# Altium project OK6410.PRJPCB (part 1 of 2)
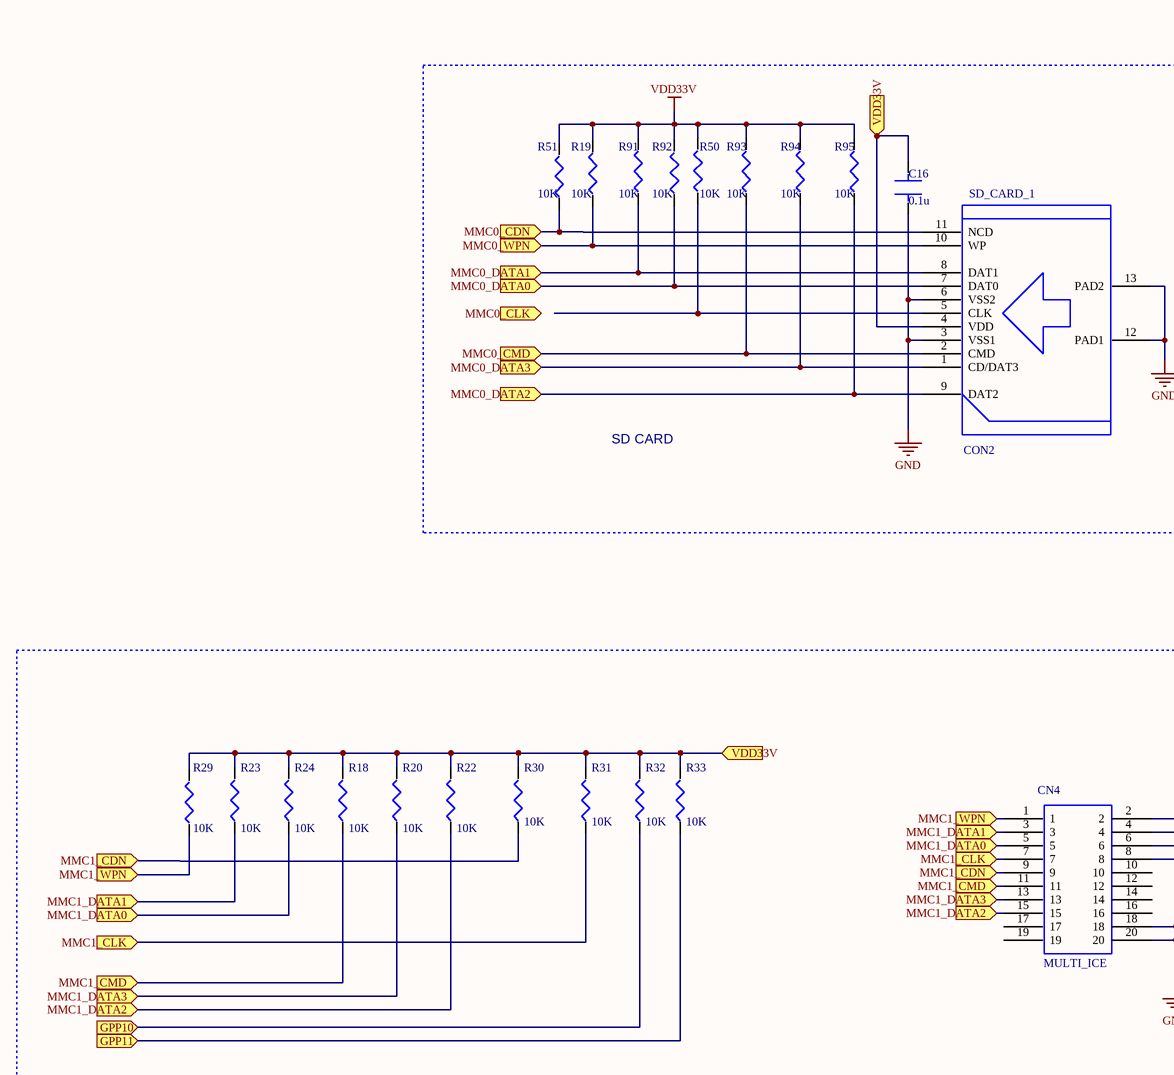
[diagram p0: SD_SD_WIFI.SchDoc, top left]
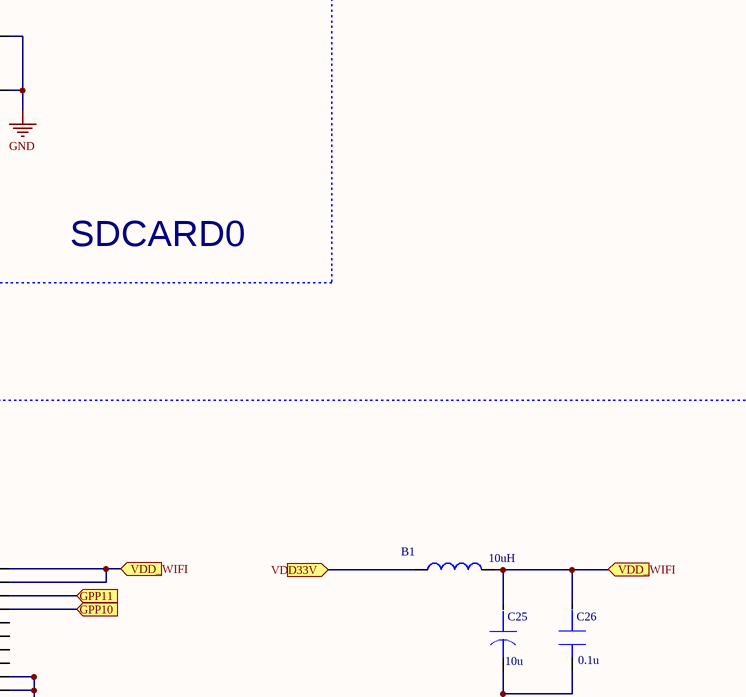
[diagram p1: SD_SD_WIFI.SchDoc, top right]
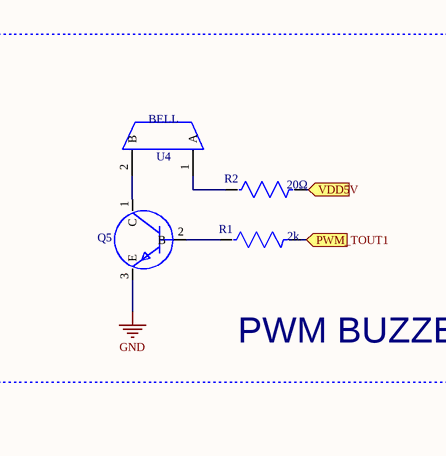
[diagram p2: SD_SD_WIFI.SchDoc, bottom left]
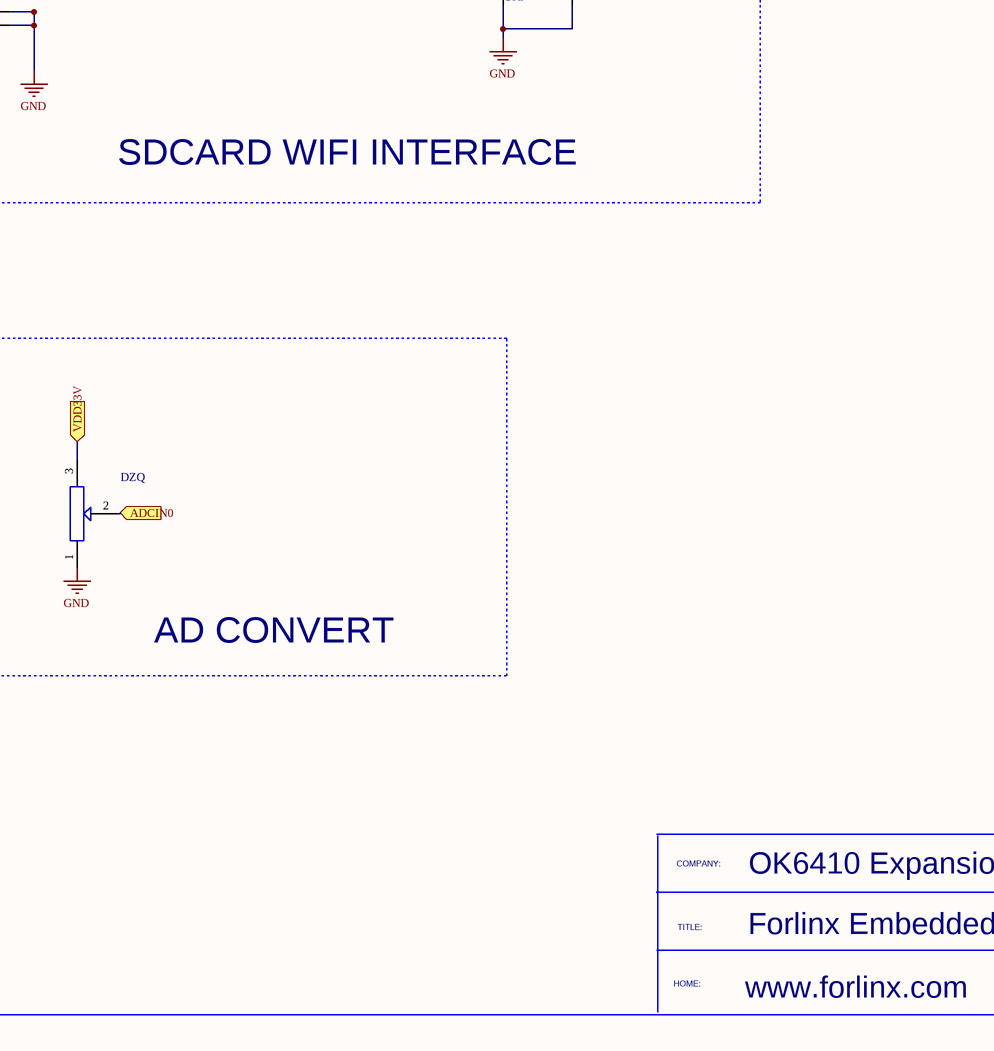
[diagram p3: SD_SD_WIFI.SchDoc, bottom right]
9 sheets, 253 parts. Net scope: flat (ports and power ports of the same name join across sheets).
Sheets:
  SD_SD_WIFI.SchDoc
  AUDIO.SchDoc
  CAM_LCD_TV.SchDoc
  COM_JTAG.SchDoc
  CON_USER_BATTER.SchDoc
  LED_USB_KEY.SchDoc
  NET.SchDoc
  POWER.SchDoc
  REVISION_HISTORY.SchDoc

## Sheet SD_SD_WIFI.SchDoc
size 558 x 431 mm

### Parts
B1  value 10uH  (hidden comment: INDUCTOR_0)
C16  value 0.1u  (hidden comment: CAP_0)
C25  value 10u  (hidden comment: CAP-AE4)
C26  value 0.1u  (hidden comment: CAP1206)
CN4  MULTI_ICE
CON2  SD_CARD_1
DZQ  VR  (value not drawn)
Q5  BC328NPN  (value not drawn)
R1  value 2k  (hidden comment: RES-1/4W)
R2  value 20Ω  (hidden comment: RES-1/4W)
R18  value 10K  (hidden comment: RESISTOR_2)
R19  value 10K  (hidden comment: RESISTOR_2)
R20  value 10K  (hidden comment: RESISTOR_2)
R22  value 10K  (hidden comment: RESISTOR_2)
R23  value 10K  (hidden comment: RESISTOR_2)
R24  value 10K  (hidden comment: RESISTOR_2)
R29  value 10K  (hidden comment: RESISTOR_2)
R30  value 10K  (hidden comment: RESISTOR_2)
R31  value 10K  (hidden comment: RESISTOR_2)
R32  value 10K  (hidden comment: RESISTOR_2)
R33  value 10K  (hidden comment: RESISTOR_2)
R50  value 10K  (hidden comment: RESISTOR_2)
R51  value 10K  (hidden comment: RESISTOR_2)
R91  value 10K  (hidden comment: RESISTOR_2)
R92  value 10K  (hidden comment: RESISTOR_2)
R93  value 10K  (hidden comment: RESISTOR_2)
R94  value 10K  (hidden comment: RESISTOR_2)
R95  value 10K  (hidden comment: RESISTOR_2)
U4  BELL

### Blocks framed on the sheet
SDCARD0: C16 CON2 R19 R50 R51 R91-R95
SDCARD WIFI INTERFACE: B1 C25 C26 CN4 R18 R20 R22-R24 R29-R33
PWM BUZZER: Q5 R1 R2 U4
AD CONVERT: DZQ

### Ports
ADCIN0, GPP10, GPP11, MMC0_CDN, MMC0_CLK, MMC0_CMD, MMC0_DATA0, MMC0_DATA1, MMC0_DATA2, MMC0_DATA3, MMC0_WPN, MMC1_CDN, MMC1_CLK, MMC1_CMD, MMC1_DATA0, MMC1_DATA1, MMC1_DATA2, MMC1_DATA3, MMC1_WPN, PWM_TOUT1, VDD5V, VDD33V, VDD_WIFI

### Nets
GND: C16.2 C25.2 C26.2 CN4.18 CN4.20 CON2.3(VSS1) CON2.6(VSS2) CON2.12(PAD1) CON2.13(PAD2) DZQ.1(VCC) Q5.3(E)
VDD33V: R19.2 R50.2 R51.2 R91.2 R92.2 R93.2 R94.2 R95.2
NetB1_1: B1.1 C16.1 CON2.4(VDD) DZQ.3(VCC) R18.2 R20.2 R22.2 R23.2 R24.2 R29.2 R30.2 R31.2 R32.2 R33.2 ; port VDD33V
NetB1_2: B1.2 C25.1 C26.1 CN4.2 CN4.4 ; port VDD_WIFI
NetB2_1: R2.2 ; port VDD5V
NetCN4_1: CN4.1 R29.1 ; port MMC1_WPN
NetCN4_3: CN4.3 R23.1 ; port MMC1_DATA1
NetCN4_5: CN4.5 R24.1 ; port MMC1_DATA0
NetCN4_6: CN4.6 R33.1 ; port GPP11
NetCN4_7: CN4.7 R31.1 ; port MMC1_CLK
NetCN4_8: CN4.8 R32.1 ; port GPP10
NetCN4_9: CN4.9 R30.1 ; port MMC1_CDN
NetCN4_11: CN4.11 R18.1 ; port MMC1_CMD
NetCN4_13: CN4.13 R20.1 ; port MMC1_DATA3
NetCN4_15: CN4.15 R22.1 ; port MMC1_DATA2
NetCON2_1: CON2.1(CD/DAT3) R94.1 ; port MMC0_DATA3
NetCON2_2: CON2.2(CMD) R93.1 ; port MMC0_CMD
NetCON2_5: CON2.5(CLK) R50.1
NetCON2_7: CON2.7(DAT0) R92.1 ; port MMC0_DATA0
NetCON2_8: CON2.8(DAT1) R91.1 ; port MMC0_DATA1
NetCON2_9: CON2.9(DAT2) R95.1 ; port MMC0_DATA2
NetCON2_10: CON2.10(WP) R19.1 ; port MMC0_WPN
NetCON2_11: CON2.11(NCD) R51.1 ; port MMC0_CDN
NetDZQ_2: DZQ.2(VCC) ; port ADCIN0
NetJ1_47: R1.2 ; port PWM_TOUT1
NetQ5_1: Q5.1(C) U4.2(B)
NetQ5_2: Q5.2(B) R1.1
NetR2_1: R2.1 U4.1(A)

Not connected (* = marked no-connect by the designer): CN4 10 12 14 16 17 19

### Notes on the sheet
- SD CARD
- COMPANY:
- TITLE:
- OK6410 Expansion Board
- HOME:
- www.forlinx.com
- Forlinx Embedded

### Library data of the parts
B1 = INDUCTOR_0: PCB DECAL: 1206
C16 = CAP_0: PCB Footprint: C2012; PCB DECAL: 0603A
C25 = CAP-AE4: ALUMINUM ELECTROLYTIC CAP.; Manufacturer #1: IPC SM-782 STD.; PCB DECAL: 3216A
C26 = CAP1206: SURFACE MOUNT CAPACITOR 0.062 X 0.126 INCHES; Manufacturer #1: IPC SM-782 STD.; PCB DECAL: 0603A
CN4 = MULTI_ICE: PCB Footprint: 3F-20PA; PCB DECAL: IDC20S
CON2 = SD_CARD_1: PCB DECAL: SD-CARD
Q5 = BC328NPN: AMPLIFIER PNP SILICON TRANSISTOR; Part Number: BC328; Manufacturer #1: MOTOROLA; PCB DECAL: SOT23T
R1 R2 = RES-1/4W: RES BODY:100  CENTERS:500; PCB DECAL: 0603A
R18-R20 R23 R24 R29-R33 R50 R51 R91-R95 = RESISTOR_2: PCB Footprint: C2012; PCB DECAL: 0603A
R22 = RESISTOR_2: PCB Footprint: C2012; Source Path: C:\WINDOW\GENERAL\2400\SCHEM\2400\SMDK2400-72F.DSN; PCB DECAL: 0603A
U4 = BELL: PCB DECAL: BELL

## Sheet AUDIO.SchDoc
size 558 x 431 mm
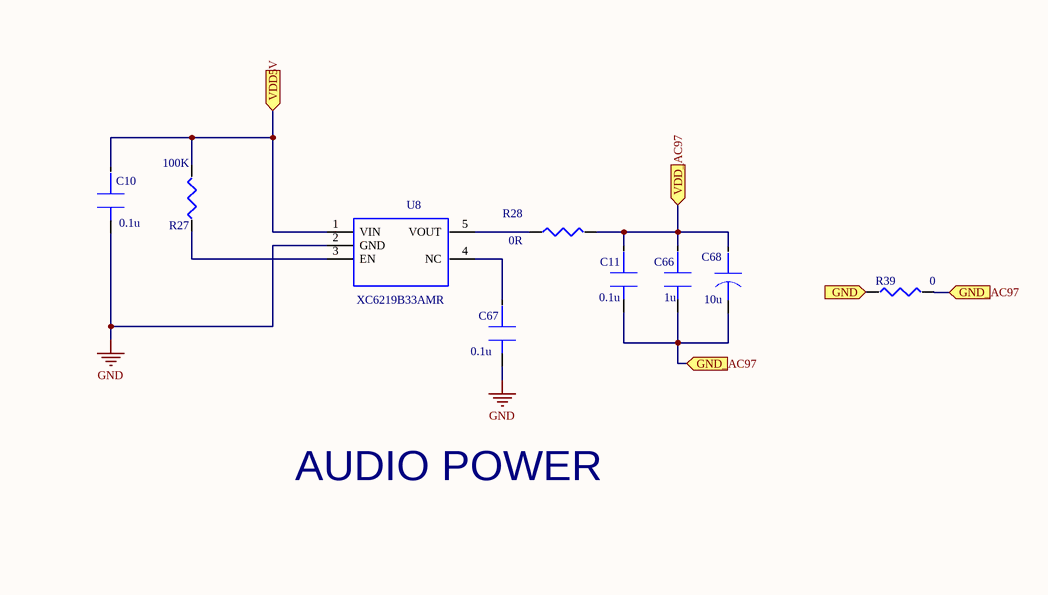
[diagram p4: AUDIO.SchDoc, top left]
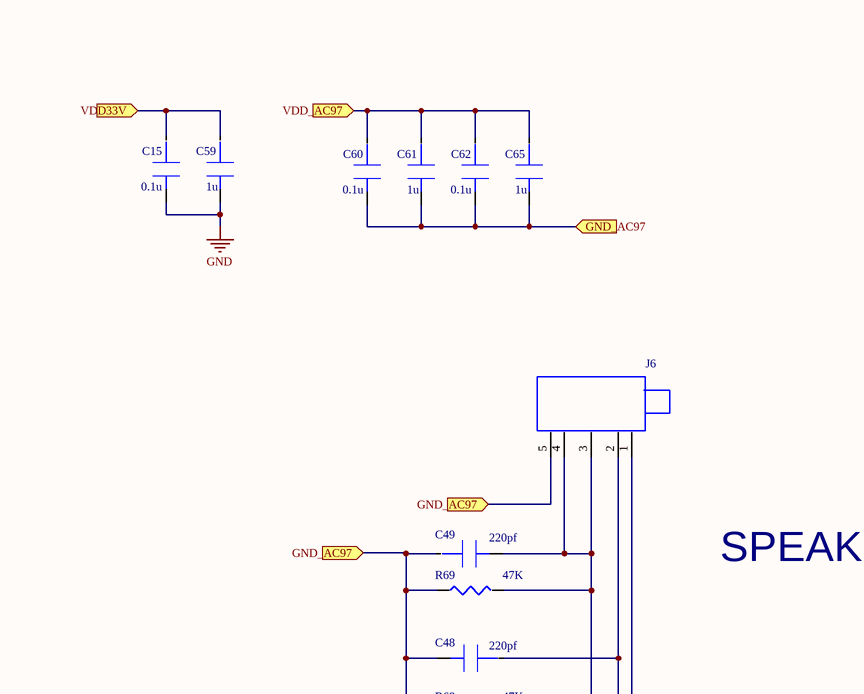
[diagram p5: AUDIO.SchDoc, top right]
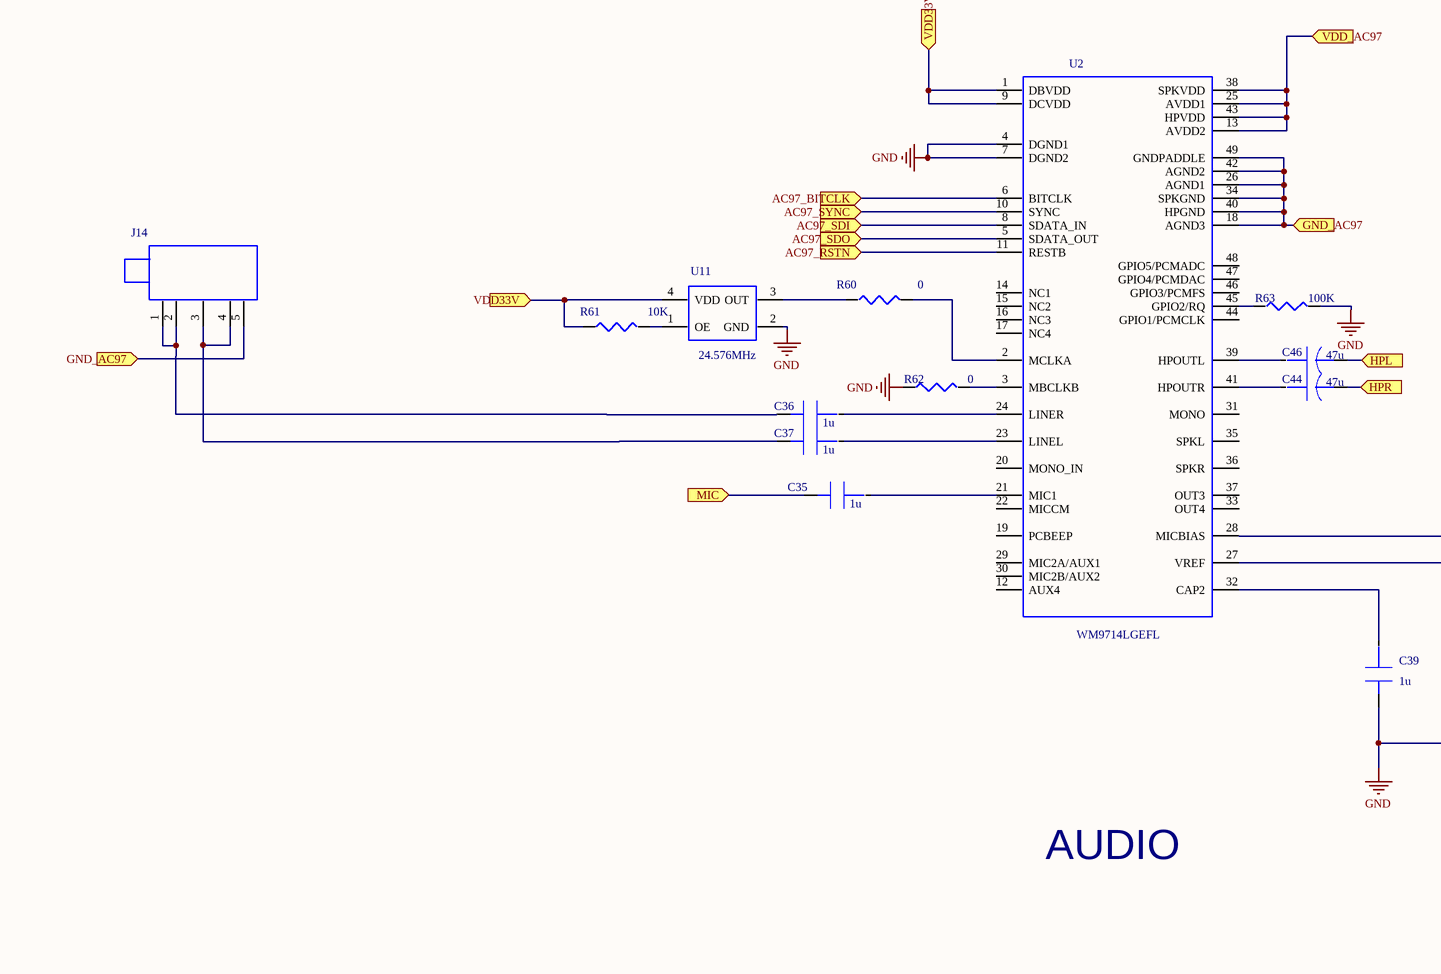
[diagram p6: AUDIO.SchDoc, bottom left]
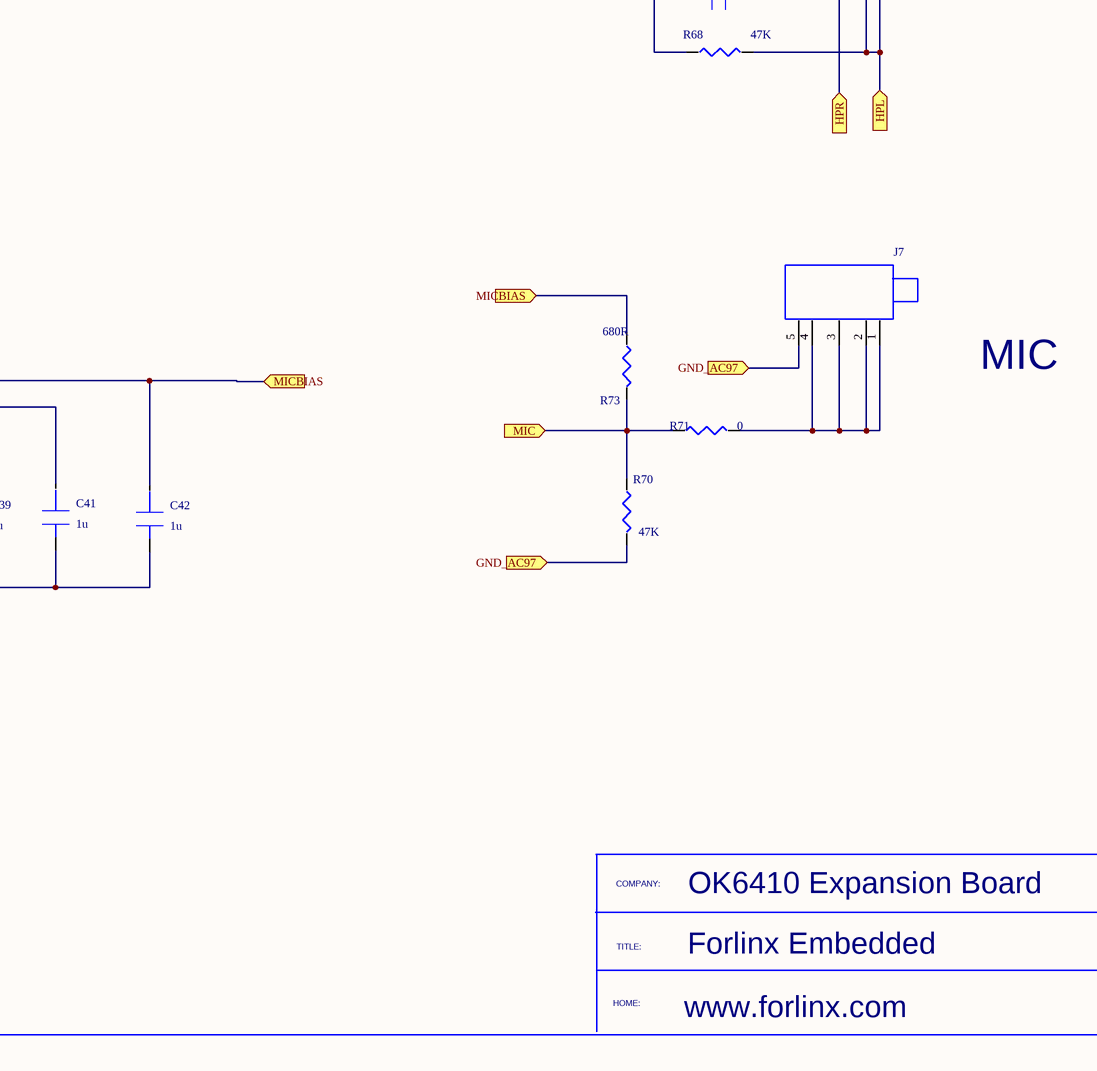
[diagram p7: AUDIO.SchDoc, bottom right]

### Parts
C10  value 0.1u  (hidden comment: CAP1206)
C11  value 0.1u  (hidden comment: CAP1206)
C15  value 0.1u  (hidden comment: CAP1206)
C35  value 1u  (hidden comment: CAP1206)
C36  value 1u  (hidden comment: CAP1206)
C37  value 1u  (hidden comment: CAP1206)
C39  value 1u  (hidden comment: CAP1206)
C41  value 1u  (hidden comment: CAP1206)
C42  value 1u  (hidden comment: CAP1206)
C44  value 47u  (hidden comment: CAP-AE4)
C46  value 47u  (hidden comment: CAP-AE4)
C48  value 220pf  (hidden comment: CAP1206)
C49  value 220pf  (hidden comment: CAP1206)
C59  value 1u  (hidden comment: CAP1206)
C60  value 0.1u  (hidden comment: CAP1206)
C61  value 1u  (hidden comment: CAP1206)
C62  value 0.1u  (hidden comment: CAP1206)
C65  value 1u  (hidden comment: CAP1206)
C66  value 1u  (hidden comment: CAP1206)
C67  value 0.1u  (hidden comment: CAP1206)
C68  value 10u  (hidden comment: CAP-AE4)
J6  MIC_SPEAKER  (value not drawn)
J7  MIC_SPEAKER  (value not drawn)
J14  MIC_SPEAKER  (value not drawn)
R27  value 100K  (hidden comment: R_0)
R28  value 0R  (hidden comment: R_0)
R39  value 0  (hidden comment: R)
R60  value 0  (hidden comment: R)
R61  value 10K  (hidden comment: R)
R62  value 0  (hidden comment: R)
R63  value 100K  (hidden comment: R)
R68  value 47K  (hidden comment: R)
R69  value 47K  (hidden comment: R)
R70  value 47K  (hidden comment: R)
R71  value 0  (hidden comment: R)
R73  value 680R  (hidden comment: R)
U2  WM9714LGEFL
U8  XC6219B33AMR
U11  value 24.576MHz  (hidden comment: Y7050)

### Ports
AC97_BITCLK, AC97_RSTN, AC97_SDI, AC97_SDO, AC97_SYNC, GND, GND_AC97, HPL, HPR, MIC, MICBIAS, VDD5V, VDD33V, VDD_AC97

### Nets
GND: C10.2 C15.2 C39.2 C41.2 C42.2 C59.2 C67.2 R62.1 R63.2 U2.4(DGND1) U2.7(DGND2) U8.2(GND) U11.2(GND)
NetB1_1: C15.1 C59.1 R61.1 U2.1(DBVDD) U2.9(DCVDD) U11.4(VDD) ; port VDD33V
NetB2_1: C10.1 R27.1 U8.1(VIN) ; port VDD5V
NetC11_1: C11.1 C60.1 C61.1 C62.1 C65.1 C66.1 C68.1 R28.1 U2.13(AVDD2) U2.25(AVDD1) U2.38(SPKVDD) U2.43(HPVDD) ; port VDD_AC97
NetC11_2: C11.2 C48.2 C49.1 C60.2 C61.2 C62.2 C65.2 C66.2 C68.2 J6.5 J7.5 J14.5 R39.2 R68.1 R69.1 R70.2 U2.18(AGND3) U2.26(AGND1) U2.34(SPKGND) U2.40(HPGND) U2.42(AGND2) U2.49(GNDPADDLE) ; port GND_AC97
NetC35_1: C35.1 U2.21(MIC1)
NetC35_2: C35.2 R70.1 R71.1 R73.2 ; port MIC
NetC36_1: C36.1 U2.24(LINER)
NetC36_2: C36.2 J14.1 J14.2
NetC37_1: C37.1 U2.23(LINEL)
NetC37_2: C37.2 J14.3 J14.4
NetC39_1: C39.1 U2.32(CAP2)
NetC41_1: C41.1 U2.27(VREF)
NetC42_1: C42.1 R73.1 U2.28(MICBIAS) ; port MICBIAS
NetC44_1: C44.1 U2.41(HPOUTR)
NetC44_2: C44.2 C49.2 J6.3 J6.4 R69.2 ; port HPR
NetC46_1: C46.1 U2.39(HPOUTL)
NetC46_2: C46.2 C48.1 J6.1 J6.2 R68.2 ; port HPL
NetC67_1: C67.1 U8.4(NC)
NetC85_1: R39.1 ; port GND
NetJ1_15: U2.11(RESTB) ; port AC97_RSTN
NetJ1_17: U2.8(SDATA_IN) ; port AC97_SDI
NetJ1_19: U2.5(SDATA_OUT) ; port AC97_SDO
NetJ1_34: U2.6(BITCLK) ; port AC97_BITCLK
NetJ1_36: U2.10(SYNC) ; port AC97_SYNC
NetJ7_1: J7.1 J7.2 J7.3 J7.4 R71.2
NetR27_2: R27.2 U8.3(EN)
NetR28_2: R28.2 U8.5(VOUT)
NetR60_1: R60.1 U11.3(OUT)
NetR60_2: R60.2 U2.2(MCLKA)
NetR61_2: R61.2 U11.1(OE)
NetR62_2: R62.2 U2.3(MBCLKB)
NetR63_1: R63.1 U2.45(GPIO2/RQ)

Not connected (* = marked no-connect by the designer): U2 12(AUX4) 14(NC1) 15(NC2) 16(NC3) 17(NC4) 19(PCBEEP) 20(MONO_IN) 22(MICCM) 29(MIC2A/AUX1) 30(MIC2B/AUX2) 31(MONO) 33(OUT4) 35(SPKL) 36(SPKR) 37(OUT3) 44(GPIO1/PCMCLK) 46(GPIO3/PCMFS) 47(GPIO4/PCMDAC) 48(GPIO5/PCMADC)

### Notes on the sheet
- AUDIO POWER
- SPEAKER
- MIC
- AUDIO
- COMPANY:
- OK6410 Expansion Board
- TITLE:
- Forlinx Embedded
- HOME:
- www.forlinx.com

### Library data of the parts
C10 C11 C15 C35-C37 C39 C41 C42 C48 C49 C59-C62 C65-C67 = CAP1206: as C26 on sheet SD_SD_WIFI
C44 C46 C68 = CAP-AE4: as C25 on sheet SD_SD_WIFI
J6 J7 J14 = MIC_SPEAKER: PCB DECAL: PHONE1
R27 R28 = R_0: PCB Footprint: C2012; PCB DECAL: 0603A
R39 R60-R63 R68-R71 R73 = R: PCB DECAL: 0603A
U2 = WM9714LGEFL: PCB DECAL: QFN48
U8 = XC6219B33AMR: PCB DECAL: XC6218B
U11 = Y7050: PART DESC: PIN4 CRYSTAL; PCB DECAL: OSCLCC

## Sheet CAM_LCD_TV.SchDoc
size 558 x 431 mm
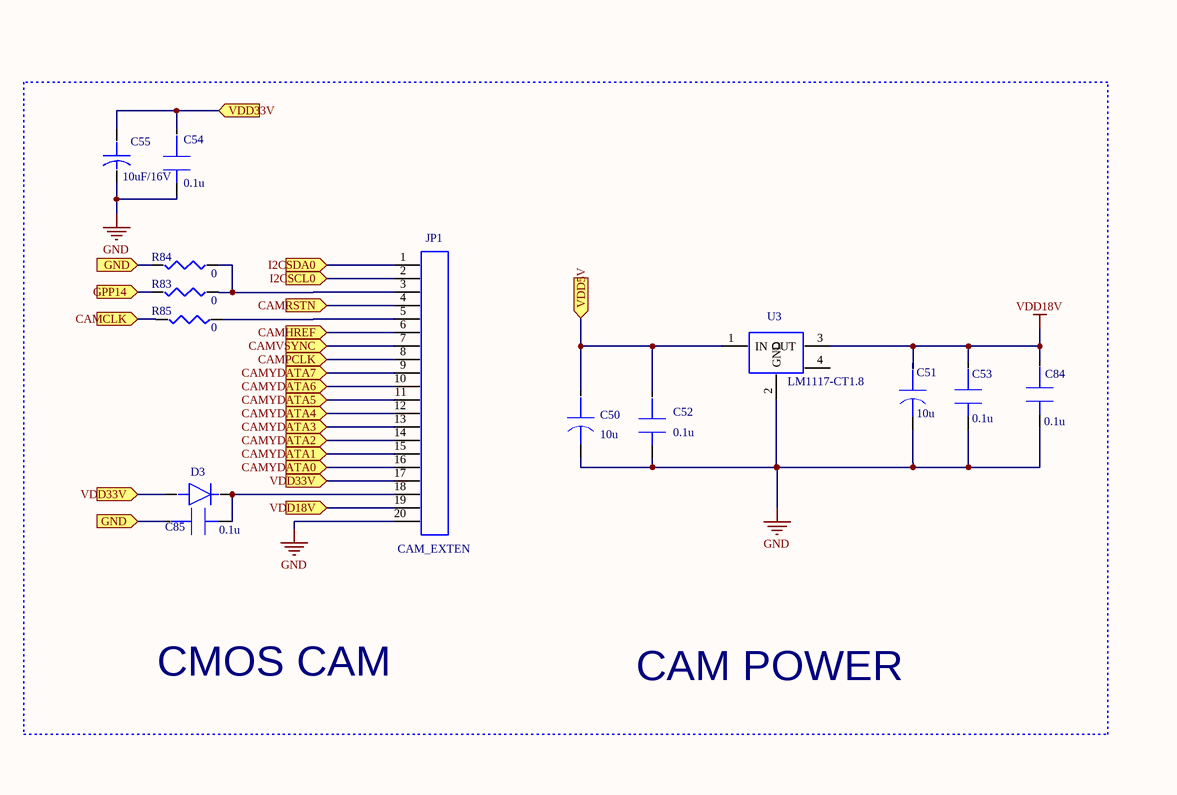
[diagram p8: CAM_LCD_TV.SchDoc, top left]
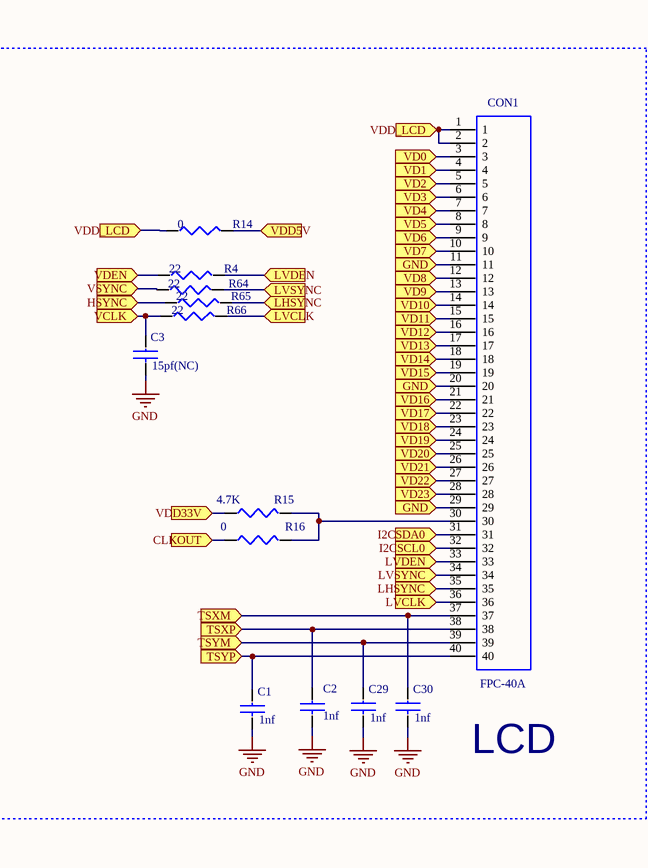
[diagram p9: CAM_LCD_TV.SchDoc, top right]
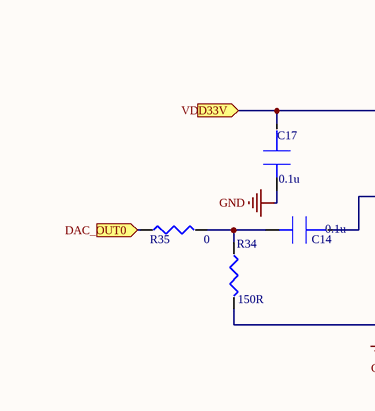
[diagram p10: CAM_LCD_TV.SchDoc, bottom left]
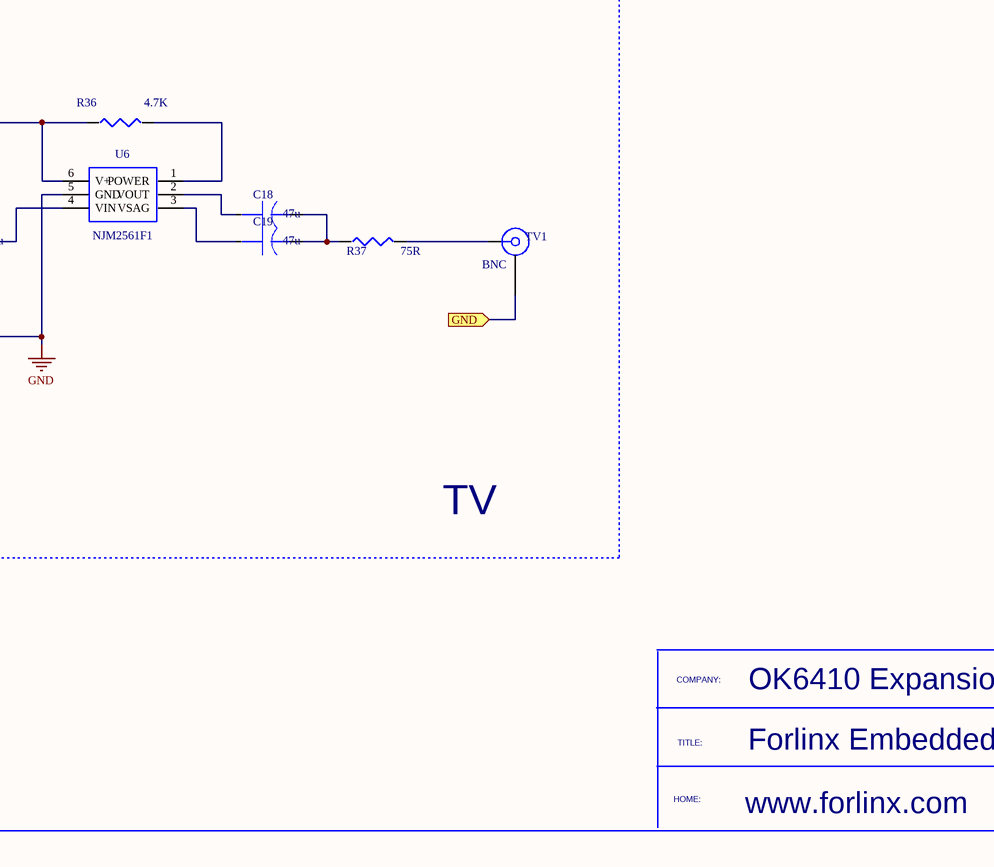
[diagram p11: CAM_LCD_TV.SchDoc, bottom right]

### Parts
C1  value 1nf  (hidden comment: CAP_NP_0)
C2  value 1nf  (hidden comment: CAP_NP_0)
C3  value 15pf(NC)  (hidden comment: CAP_NP_0)
C14  value 0.1u  (hidden comment: CAP1206)
C17  value 0.1u  (hidden comment: CAP1206)
C18  value 47u  (hidden comment: CAP-AE4)
C19  value 47u  (hidden comment: CAP-AE4)
C29  value 1nf  (hidden comment: CAP_NP_0)
C30  value 1nf  (hidden comment: CAP_NP_0)
C50  value 10u  (hidden comment: CAP-AE4)
C51  value 10u  (hidden comment: CAP-AE4)
C52  value 0.1u  (hidden comment: CAP1206)
C53  value 0.1u  (hidden comment: CAP1206)
C54  value 0.1u  (hidden comment: CAP1206)
C55  value 10uF/16V  (hidden comment: CAPACITOR_POL_0B)
C84  value 0.1u  (hidden comment: CAP1206)
C85  value 0.1u  (hidden comment: CAP1206)
CON1  FPC-40A
D3  DIODE  (value not drawn)
JP1  CAM_EXTEN
R4  value 22  (hidden comment: RESISTOR_2)
R14  value 0  (hidden comment: RESISTOR_2)
R15  value 4.7K  (hidden comment: RESISTOR_2)
R16  value 0  (hidden comment: RESISTOR_2)
R34  value 150R  (hidden comment: R)
R35  value 0  (hidden comment: R)
R36  value 4.7K  (hidden comment: R)
R37  value 75R  (hidden comment: R)
R64  value 22  (hidden comment: RESISTOR_2)
R65  value 22  (hidden comment: RESISTOR_2)
R66  value 22  (hidden comment: RESISTOR_2)
R83  value 0  (hidden comment: R_0)
R84  value 0  (hidden comment: R_0)
R85  value 0  (hidden comment: R_0)
TV1  value BNC  (hidden comment: BNC_1)
U3  LM1117-CT1.8
U6  NJM2561F1

### Blocks framed on the sheet
LCD: C1-C3 C29 C30 CON1 R4 R14-R16 R64-R66
TV: C14 C17-C19 R34-R37 TV1 U6

### Ports
CAMCLK, CAMHREF, CAMPCLK, CAMRSTN, CAMVSYNC, CAMYDATA0, CAMYDATA1, CAMYDATA2, CAMYDATA3, CAMYDATA4, CAMYDATA5, CAMYDATA6, CAMYDATA7, CLKOUT, DAC_OUT0, GND, GPP14, HSYNC, I2CSCL0, I2CSDA0, LHSYNC, LVCLK, LVDEN, LVSYNC, TSXM, TSXP, TSYM, TSYP, VCLK, VD0, VD1, VD2, VD3, VD4, VD5, VD6, VD7, VD8, VD9, VD10, VD11, VD12, VD13, VD14, VD15, VD16, VD17, VD18, VD19, VD20, VD21, VD22, VD23, VDD5V, VDD18V, VDD33V, VDD_LCD, VDEN, VSYNC

### Nets
GND: C1.2 C2.2 C3.2 C17.2 C29.2 C30.2 C50.2 C51.2 C52.2 C53.2 C54.2 C55.2 C84.2 JP1.20 R34.2 U3.2(GND) U6.5(GND)
VDD18V: C51.1 C53.1 C84.1 U3.3(OUT)
NetB1_1: C17.1 C54.1 C55.1 D3.2(A) JP1.17 R15.2 R36.1 U6.6(V+) ; port VDD33V
NetB2_1: C50.1 C52.1 R14.2 U3.1(IN) ; port VDD5V
NetC1_1: C1.1 CON1.40 ; port TSYP
NetC2_1: C2.1 CON1.38 ; port TSXP
NetC3_1: C3.1 R66.1 ; port VCLK
NetC14_1: C14.1 U6.4(VIN)
NetC14_2: C14.2 R34.1 R35.2
NetC18_1: C18.1 U6.2(VOUT)
NetC18_2: C18.2 C19.2 R37.1
NetC19_1: C19.1 U6.3(VSAG)
NetC29_1: C29.1 CON1.39 ; port TSYM
NetC30_1: C30.1 CON1.37 ; port TSXM
NetC85_1: C85.1 CON1.11 CON1.20 CON1.29 R84.2 TV1.2(SHIELD) ; port GND
NetC85_2: C85.2 D3.1(K) JP1.18
NetCON1_1: CON1.1 CON1.2 R14.1 ; port VDD_LCD
NetCON1_3: CON1.3 ; port VD0
NetCON1_4: CON1.4 ; port VD1
NetCON1_5: CON1.5 ; port VD2
NetCON1_6: CON1.6 ; port VD3
NetCON1_7: CON1.7 ; port VD4
NetCON1_8: CON1.8 ; port VD5
NetCON1_9: CON1.9 ; port VD6
NetCON1_10: CON1.10 ; port VD7
NetCON1_12: CON1.12 ; port VD8
NetCON1_13: CON1.13 ; port VD9
NetCON1_14: CON1.14 ; port VD10
NetCON1_15: CON1.15 ; port VD11
NetCON1_16: CON1.16 ; port VD12
NetCON1_17: CON1.17 ; port VD13
NetCON1_18: CON1.18 ; port VD14
NetCON1_19: CON1.19 ; port VD15
NetCON1_21: CON1.21 ; port VD16
NetCON1_22: CON1.22 ; port VD17
NetCON1_23: CON1.23 ; port VD18
NetCON1_24: CON1.24 ; port VD19
NetCON1_25: CON1.25 ; port VD20
NetCON1_26: CON1.26 ; port VD21
NetCON1_27: CON1.27 ; port VD22
NetCON1_28: CON1.28 ; port VD23
NetCON1_30: CON1.30 R15.1 R16.1
NetCON1_31: CON1.31 JP1.1 ; port I2CSDA0
NetCON1_32: CON1.32 JP1.2 ; port I2CSCL0
NetCON1_33: CON1.33 R4.2 ; port LVDEN
NetCON1_34: CON1.34 R64.2 ; port LVSYNC
NetCON1_35: CON1.35 R65.2 ; port LHSYNC
NetCON1_36: CON1.36 R66.2 ; port LVCLK
NetJ1_39: JP1.10 ; port CAMYDATA6
NetJ1_40: R16.2 ; port CLKOUT
NetJ1_41: JP1.13 ; port CAMYDATA3
NetJ1_43: JP1.12 ; port CAMYDATA4
NetJ1_45: JP1.4 ; port CAMRSTN
NetJ1_49: JP1.8 ; port CAMPCLK
NetJ1_51: R85.2 ; port CAMCLK
NetJ1_55: JP1.15 ; port CAMYDATA1
NetJ1_71: JP1.9 ; port CAMYDATA7
NetJ1_72: JP1.11 ; port CAMYDATA5
NetJ1_73: JP1.14 ; port CAMYDATA2
NetJ1_74: JP1.16 ; port CAMYDATA0
NetJ1_75: JP1.7 ; port CAMVSYNC
NetJ1_76: JP1.6 ; port CAMHREF
NetJ2_52: R64.1 ; port VSYNC
NetJ3_3: R4.1 ; port VDEN
NetJ3_4: R65.1 ; port HSYNC
NetJ3_52: R35.1 ; port DAC_OUT0
NetJ3_55: R83.2 ; port GPP14
NetJP1_3: JP1.3 R83.1 R84.1
NetJP1_5: JP1.5 R85.1
NetJP1_19: JP1.19 ; port VDD18V
NetR36_2: R36.2 U6.1(POWER)
NetR37_2: R37.2 TV1.1(CENTER)

Not connected (* = marked no-connect by the designer): U3 4

### Notes on the sheet
- CMOS CAM
- CAM POWER
- COMPANY:
- OK6410 Expansion Board
- TITLE:
- Forlinx Embedded
- HOME:
- www.forlinx.com

### Library data of the parts
C1-C3 C29 C30 = CAP_NP_0: PCB Footprint: C2012; PCB DECAL: 0603A
C14 C17 C52-C54 C84 C85 = CAP1206: as C26 on sheet SD_SD_WIFI
C18 C19 C50 C51 = CAP-AE4: as C25 on sheet SD_SD_WIFI
C55 = CAPACITOR_POL_0B: PCB Footprint: C3216; PCB DECAL: 3216A
CON1 = FPC-40A: PCB DECAL: FPC40
D3 = DIODE: GENERIC DIODE W ALTERNATE; Sim.Analog.Model: d1n914; Sim.Analog.Order: Model$; Sim.Analog.Prefix: D; PCB DECAL: LED1206N
JP1 = CAM_EXTEN: PCB DECAL: IDC20S
R4 R14-R16 R64-R66 = RESISTOR_2: PCB Footprint: C2012; PCB DECAL: 0603A
R34-R37 = R: PCB DECAL: 0603A
R83-R85 = R_0: PCB Footprint: C2012; PCB DECAL: 0603A
TV1 = BNC_1: PCB Footprint: con_av; PCB DECAL: TVB
U3 = LM1117-CT1.8: PCB DECAL: TO-252L
U6 = NJM2561F1: PCB DECAL: MTP6

## Sheet COM_JTAG.SchDoc
size 558 x 431 mm
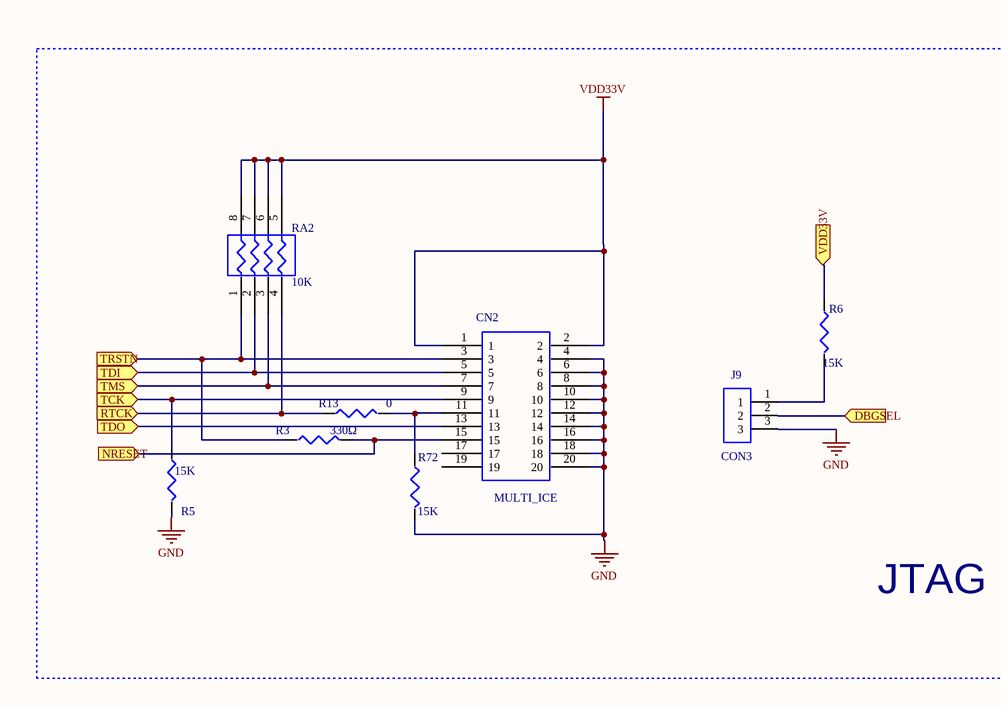
[diagram p12: COM_JTAG.SchDoc, top left]
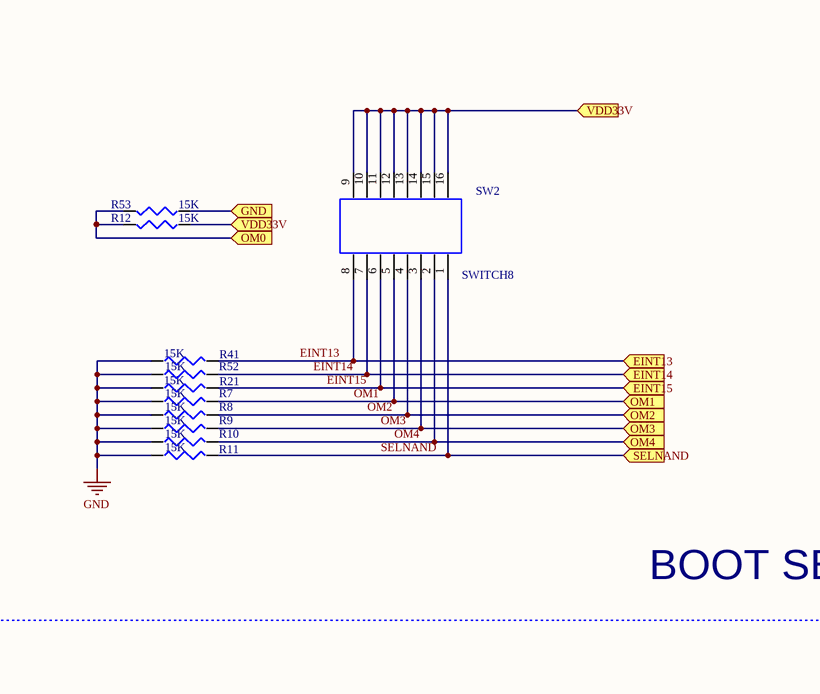
[diagram p13: COM_JTAG.SchDoc, top right]
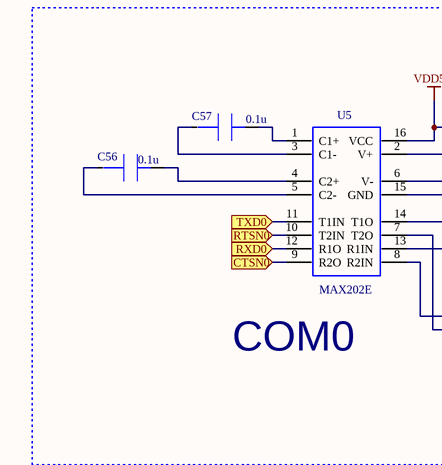
[diagram p14: COM_JTAG.SchDoc, bottom left]
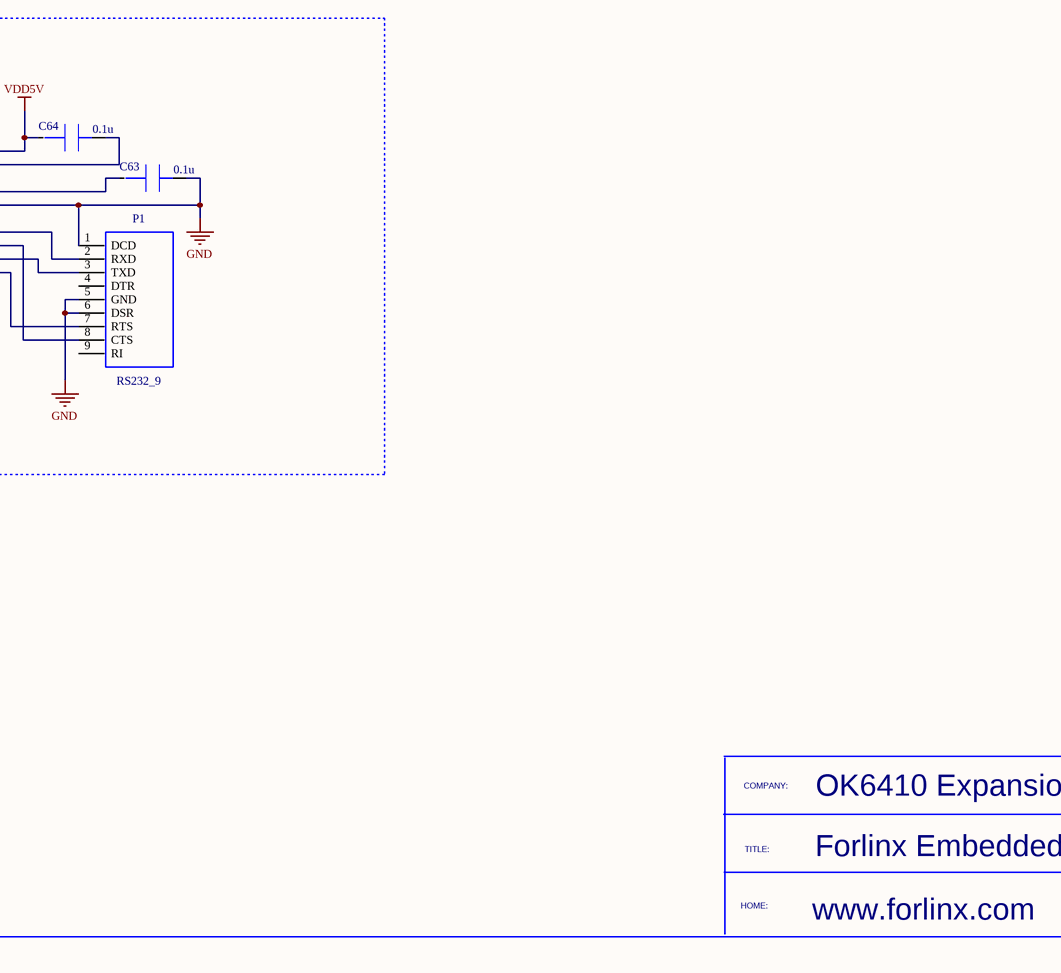
[diagram p15: COM_JTAG.SchDoc, bottom right]

### Parts
C56  value 0.1u  (hidden comment: CAP1206)
C57  value 0.1u  (hidden comment: CAP1206)
C63  value 0.1u  (hidden comment: CAP1206)
C64  value 0.1u  (hidden comment: CAP1206)
CN2  MULTI_ICE
J9  CON3
P1  RS232_9
R3  value 330Ω  (hidden comment: RESISTOR_2)
R5  value 15K  (hidden comment: RESISTOR_2)
R6  value 15K  (hidden comment: RESISTOR_2)
R7  value 15K  (hidden comment: RESISTOR_2)
R8  value 15K  (hidden comment: RESISTOR_2)
R9  value 15K  (hidden comment: RESISTOR_2)
R10  value 15K  (hidden comment: RESISTOR_2)
R11  value 15K  (hidden comment: RESISTOR_2)
R12  value 15K  (hidden comment: RESISTOR_2)
R13  value 0  (hidden comment: R)
R21  value 15K  (hidden comment: RESISTOR_2)
R41  value 15K  (hidden comment: RESISTOR_2)
R52  value 15K  (hidden comment: RESISTOR_2)
R53  value 15K  (hidden comment: RESISTOR_2)
R72  value 15K  (hidden comment: RESISTOR_2)
RA2  value 10K  (hidden comment: RP4R)
SW2  SWITCH8
U5  MAX202E

### Blocks framed on the sheet
JTAG: CN2 J9 R3 R5 R6 R13 R72 RA2
BOOT SELECT: R7-R12 R21 R41 R52 R53 SW2
COM0: C56 C57 C63 C64 P1 U5

### Ports
CTSN0, DBGSEL, EINT13, EINT14, EINT15, GND, NRESET, OM0, OM1, OM2, OM3, OM4, RTCK, RTSN0, RXD0, SELNAND, TCK, TDI, TDO, TMS, TRSTN, TXD0, VDD33V

### Nets
GND: C63.2 CN2.4 CN2.6 CN2.8 CN2.10 CN2.12 CN2.14 CN2.16 CN2.18 CN2.20 J9.3 P1.1(DCD) P1.5(GND) P1.6(DSR) R5.1 R7.1 R8.1 R9.1 R10.1 R11.1 R21.1 R41.1 R52.1 R72.1 U5.15(GND)
VDD5V: C64.1 U5.16(VCC)
VDD33V: CN2.1 CN2.2 RA2.5(R42) RA2.6(R32) RA2.7(R22) RA2.8(R11)
EINT13: R41.2 SW2.8 ; port EINT13
EINT14: R52.2 SW2.7 ; port EINT14
EINT15: R21.2 SW2.6 ; port EINT15
OM1: R7.2 SW2.5 ; port OM1
OM2: R8.2 SW2.4 ; port OM2
OM3: R9.2 SW2.3 ; port OM3
OM4: R10.2 SW2.2 ; port OM4
SELNAND: R11.2 SW2.1 ; port SELNAND
NetB1_1: R6.2 R12.1 SW2.9 SW2.10 SW2.11 SW2.12 SW2.13 SW2.14 SW2.15 SW2.16 ; port VDD33V
NetC56_1: C56.1 U5.5(C2-)
NetC56_2: C56.2 U5.4(C2+)
NetC57_1: C57.1 U5.3(C1-)
NetC57_2: C57.2 U5.1(C1+)
NetC63_1: C63.1 U5.6(V-)
NetC64_2: C64.2 U5.2(V+)
NetC85_1: R53.1 ; port GND
NetCN2_3: CN2.3 R3.2 RA2.1(R12) ; port TRSTN
NetCN2_5: CN2.5 RA2.2(R21) ; port TDI
NetCN2_7: CN2.7 RA2.3(R31) ; port TMS
NetCN2_9: CN2.9 R5.2 ; port TCK
NetCN2_11: CN2.11 R13.2 R72.2
NetCN2_13: CN2.13 ; port TDO
NetCN2_15: CN2.15 R3.1 ; port NRESET
NetJ1_31: U5.12(R1O) ; port RXD0
NetJ1_37: U5.9(R2O) ; port CTSN0
NetJ1_68: U5.10(T2IN) ; port RTSN0
NetJ1_70: U5.11(T1IN) ; port TXD0
NetJ3_25: R13.1 RA2.4(R41) ; port RTCK
NetJ3_30: R12.2 R53.2 ; port OM0
NetJ3_34: J9.2 ; port DBGSEL
NetJ9_1: J9.1 R6.1
NetP1_2: P1.2(RXD) U5.14(T1O)
NetP1_3: P1.3(TXD) U5.13(R1IN)
NetP1_7: P1.7(RTS) U5.8(R2IN)
NetP1_8: P1.8(CTS) U5.7(T2O)

Not connected (* = marked no-connect by the designer): CN2 17 19; P1 4(DTR) 9(RI)

### Notes on the sheet
- COMPANY:
- OK6410 Expansion Board
- TITLE:
- Forlinx Embedded
- HOME:
- www.forlinx.com

### Library data of the parts
C56 C57 C63 C64 = CAP1206: as C26 on sheet SD_SD_WIFI
CN2 = MULTI_ICE: as CN4 on sheet SD_SD_WIFI
J9 = CON3: PCB DECAL: SIP3S
P1 = RS232_9: PCB DECAL: DB9-HF
R3 R5-R12 R21 R41 R52 R53 R72 = RESISTOR_2: PCB Footprint: C2012; PCB DECAL: 0603A
R13 = R: PCB DECAL: 0603A
RA2 = RP4R: 1ST PART FIELD: 22; PCB Footprint: R-AR4; PCB DECAL: R-AR4
U5 = MAX202E: PCB DECAL: SO16NB
SW2 = SWITCH8: PCB DECAL: SWITCH8

## Sheet CON_USER_BATTER.SchDoc
size 558 x 431 mm
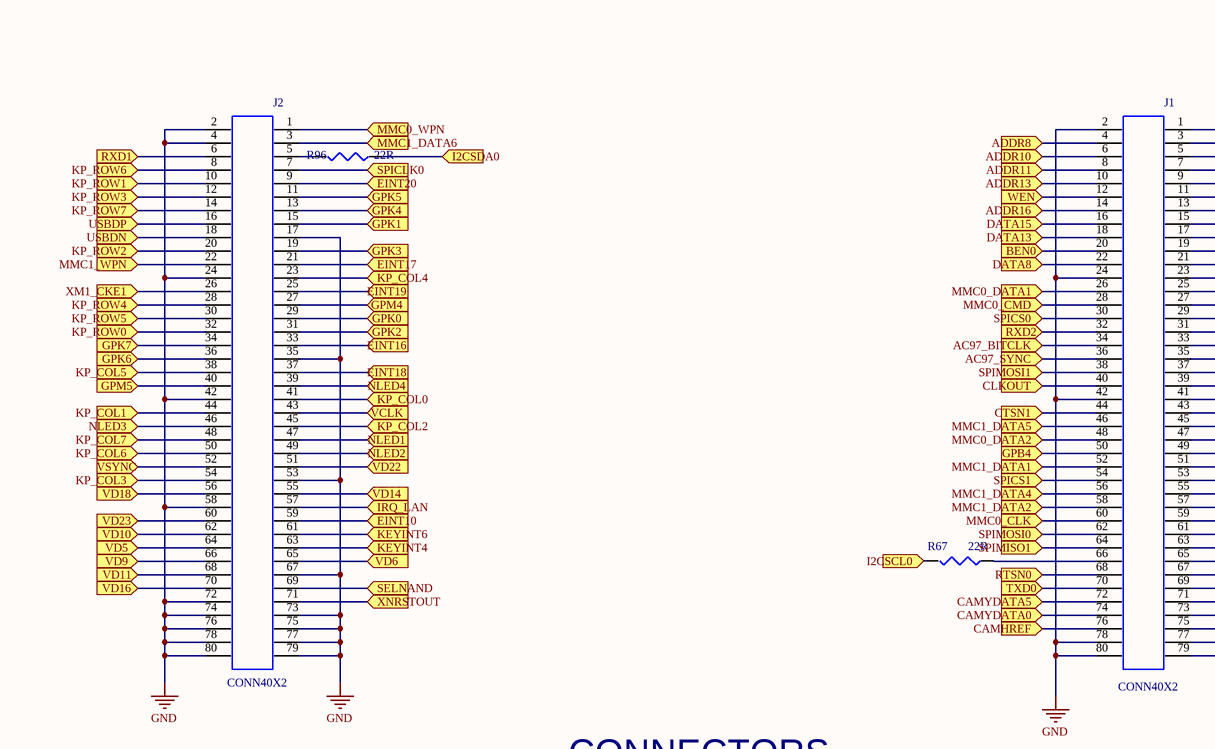
[diagram p16: CON_USER_BATTER.SchDoc, top left]
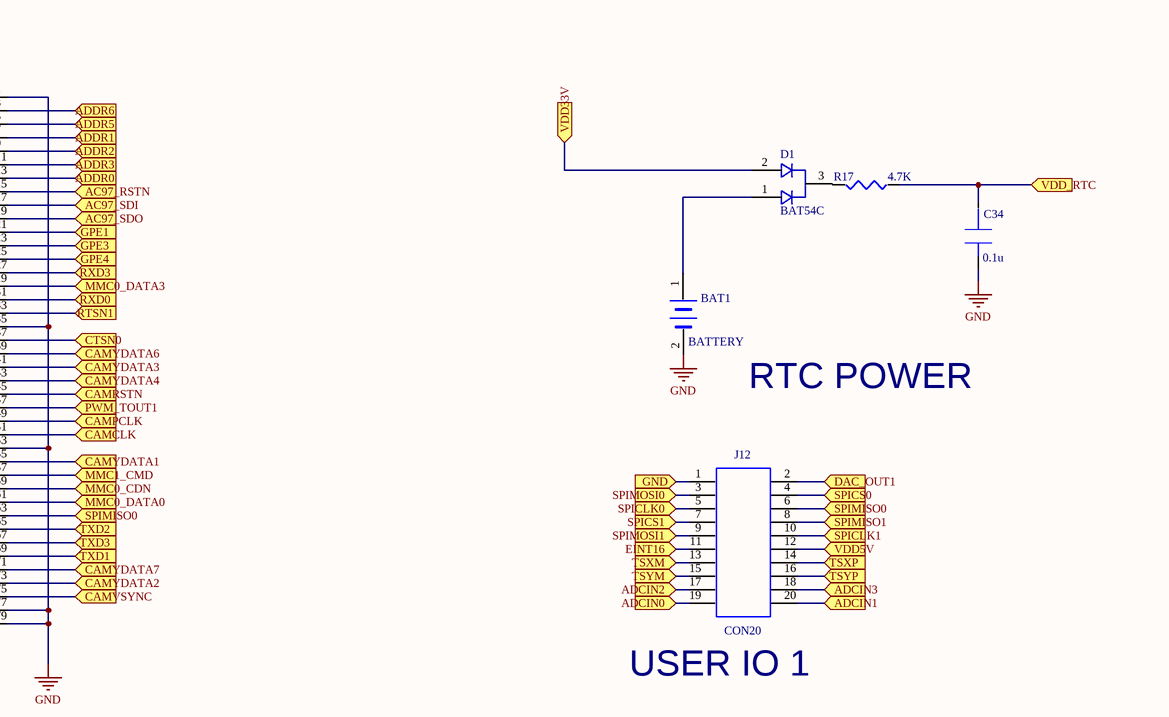
[diagram p17: CON_USER_BATTER.SchDoc, top right]
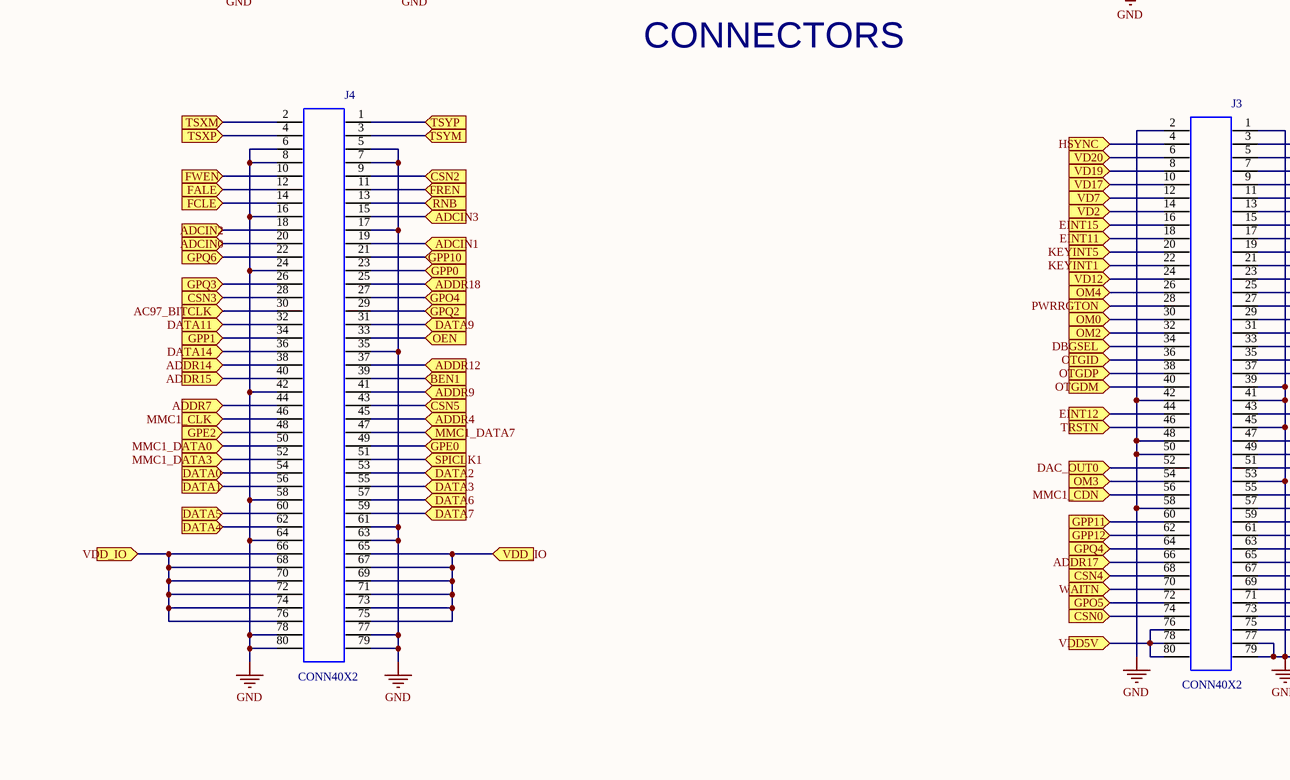
[diagram p18: CON_USER_BATTER.SchDoc, bottom left]
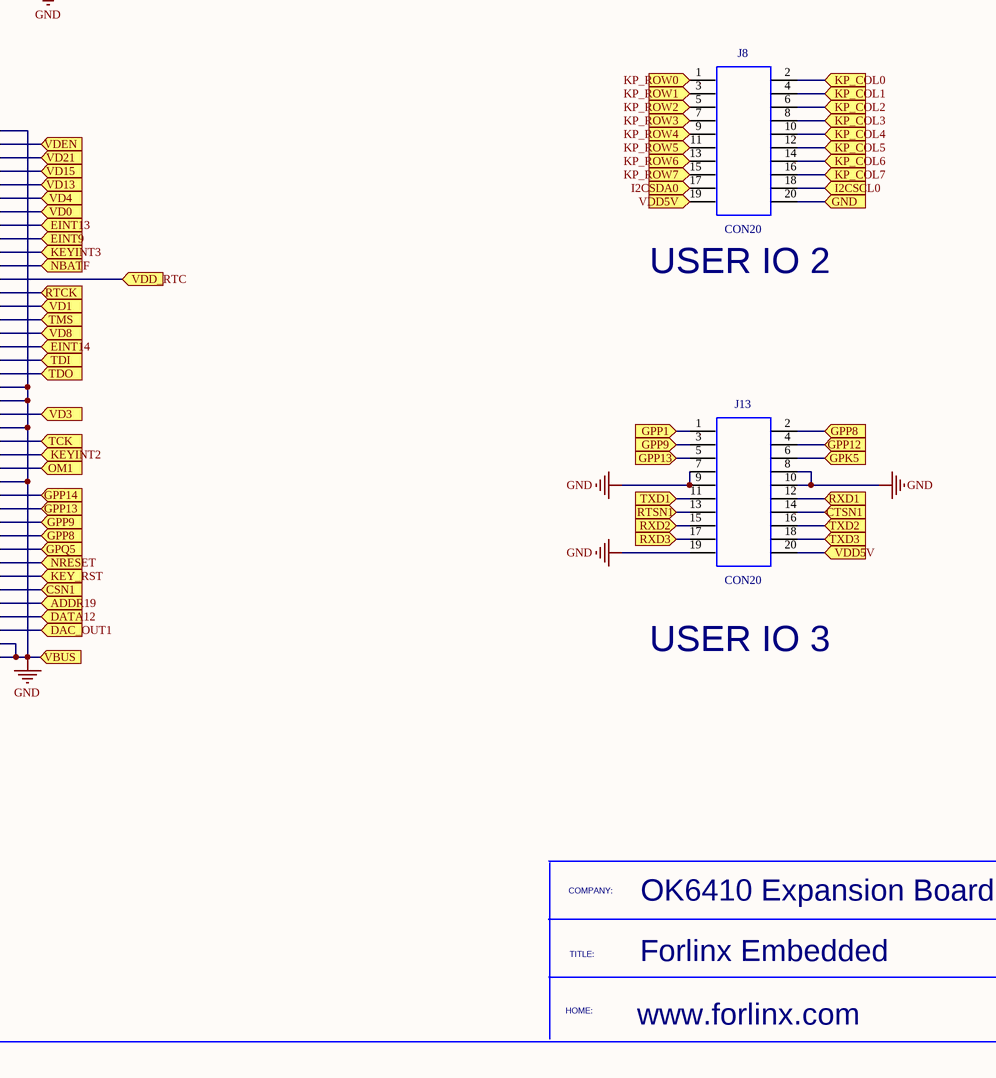
[diagram p19: CON_USER_BATTER.SchDoc, bottom right]

### Parts
BAT1  BATTERY
C34  value 0.1u  (hidden comment: CAP1206)
D1  BAT54C  [SOT23]
J1  CONN40X2
J2  CONN40X2
J3  CONN40X2
J4  CONN40X2
J8  CON20
J12  CON20
J13  CON20
R17  value 4.7K  (hidden comment: RESISTOR_2)
R67  value 22R  (hidden comment: RESISTOR_2)
R96  value 22R  (hidden comment: RESISTOR_2)

### Ports
AC97_BITCLK, AC97_RSTN, AC97_SDI, AC97_SDO, AC97_SYNC, ADCIN0, ADCIN1, ADCIN2, ADCIN3, ADDR0, ADDR1, ADDR2, ADDR3, ADDR4, ADDR5, ADDR6, ADDR7, ADDR8, ADDR9, ADDR10, ADDR11, ADDR12, ADDR13, ADDR14, ADDR15, ADDR16, ADDR17, ADDR18, ADDR19, BEN0, BEN1, CAMCLK, CAMHREF, CAMPCLK, CAMRSTN, CAMVSYNC, CAMYDATA0, CAMYDATA1, CAMYDATA2, CAMYDATA3, CAMYDATA4, CAMYDATA5, CAMYDATA6, CAMYDATA7, CLKOUT, CSN0, CSN1, CSN2, CSN3, CSN4, CSN5, CTSN0, CTSN1, DAC_OUT0, DAC_OUT1, DATA0, DATA1, DATA2, DATA3, DATA4, DATA5, DATA6, DATA7, DATA8, DATA9, DATA11, DATA12, DATA13, DATA14, DATA15, DBGSEL, EINT9, EINT10, EINT11, EINT12, EINT13, EINT14, EINT15, EINT16, EINT17, EINT18, EINT19, EINT20, FALE, FCLE, FREN, FWEN, GND, GPB4, GPE0, GPE1, GPE2, GPE3, GPE4, GPK0, GPK1, GPK2, GPK3, GPK4, GPK5, GPK6, GPK7, GPM4, GPM5, GPO4, GPO5, GPP0, GPP1, GPP8, GPP9, GPP10, GPP11, GPP12, GPP13, GPP14, GPQ2, GPQ3, GPQ4, GPQ5, GPQ6, HSYNC, I2CSCL0, I2CSDA0, IRQ_LAN, KEY_RST, KEYINT1, KEYINT2, KEYINT3, KEYINT4, KEYINT5, KEYINT6, KP_COL0, KP_COL1, KP_COL2, KP_COL3, KP_COL4, KP_COL5, KP_COL6, KP_COL7, KP_ROW0, KP_ROW1, KP_ROW2, KP_ROW3, KP_ROW4, KP_ROW5, KP_ROW6, KP_ROW7, MMC0_CDN, MMC0_CLK, MMC0_CMD, MMC0_DATA0, MMC0_DATA1, MMC0_DATA2, MMC0_DATA3, MMC0_WPN, MMC1_CDN, MMC1_CLK, MMC1_CMD, MMC1_DATA0, MMC1_DATA1, MMC1_DATA2, MMC1_DATA3, MMC1_DATA4, MMC1_DATA5, MMC1_DATA6, MMC1_DATA7, MMC1_WPN, NBATF, NLED1, NLED2, NLED3, NLED4, NRESET, OEN, OM0, OM1, OM2, OM3, OM4, OTGDM, OTGDP, OTGID, PWM_TOUT1, PWRRGTON, RNB, RTCK, RTSN0, RTSN1, RXD0, RXD1, RXD2, RXD3, SELNAND, SPICLK0, SPICLK1, SPICS0, SPICS1, SPIMISO0, SPIMISO1, SPIMOSI0, SPIMOSI1, TCK, TDI, TDO, TMS, TRSTN, TSXM, TSXP, TSYM, TSYP, TXD0, TXD1, TXD2, TXD3, USBDN, USBDP, VBUS, VCLK, VD0, VD1, VD2, VD3, VD4, VD5, VD6, VD7, VD8, VD9, VD10, VD11, VD12, VD13, VD14, VD15, VD16, VD17, VD18, VD19, VD20, VD21, VD22, VD23, VDD5V, VDD33V, VDD_IO, VDD_RTC, VDEN, VSYNC, WAITN, WEN, XM1_CKE1, XNRSTOUT

### Nets
GND: BAT1.2 C34.2 J1.1 J1.2 J1.24 J1.35 J1.42 J1.53 J1.77 J1.78 J1.79 J1.80 J2.2 J2.4 J2.17 J2.24 J2.35 J2.42 J2.53 J2.58 J2.67 J2.72 J2.73 J2.74 J2.75 J2.76 J2.77 J2.78 J2.79 J2.80 J3.1 J3.2 J3.39 J3.41 J3.42 J3.45 J3.48 J3.50 J3.53 J3.58 J3.77 J3.79 J4.5 J4.6 J4.7 J4.8 J4.16 J4.17 J4.24 J4.35 J4.42 J4.58 J4.61 J4.63 J4.64 J4.77 J4.78 J4.79 J4.80 J13.7 J13.8 J13.9 J13.10 J13.19 ; port VBUS
EINT13: J3.15 ; port EINT13
EINT14: J3.33 ; port EINT14
EINT15: J3.16 ; port EINT15
OM1: J3.51 ; port OM1
OM2: J3.32 ; port OM2
OM3: J3.54 ; port OM3
OM4: J3.26 ; port OM4
SELNAND: J2.69 ; port SELNAND
NetB1_1: D1.2 ; port VDD33V
NetB2_1: J3.76 J3.78 J3.80 J8.19 J12.12 J13.20 ; port VDD5V
NetBAT1_1: BAT1.1 D1.1
NetC1_1: J4.1 J12.16 ; port TSYP
NetC2_1: J4.4 J12.14 ; port TSXP
NetC3_1: J2.43 ; port VCLK
NetC29_1: J4.3 J12.15 ; port TSYM
NetC30_1: J4.2 J12.13 ; port TSXM
NetC34_1: C34.1 J3.23 R17.1 ; port VDD_RTC
NetC72_1: J4.65 J4.66 J4.67 J4.68 J4.69 J4.70 J4.71 J4.72 J4.73 J4.74 J4.75 J4.76 ; port VDD_IO
NetC85_1: J8.20 J12.1 ; port GND
NetCN2_3: J3.46 ; port TRSTN
NetCN2_5: J3.35 ; port TDI
NetCN2_7: J3.29 ; port TMS
NetCN2_9: J3.47 ; port TCK
NetCN2_13: J3.37 ; port TDO
NetCN2_15: J3.65 ; port NRESET
NetCN4_1: J2.22 ; port MMC1_WPN
NetCN4_3: J1.52 ; port MMC1_DATA1
NetCN4_5: J4.50 ; port MMC1_DATA0
NetCN4_6: J3.60 ; port GPP11
NetCN4_7: J4.46 ; port MMC1_CLK
NetCN4_8: J4.21 ; port GPP10
NetCN4_9: J3.56 ; port MMC1_CDN
NetCN4_11: J1.57 ; port MMC1_CMD
NetCN4_13: J4.52 ; port MMC1_DATA3
NetCN4_15: J1.58 ; port MMC1_DATA2
NetCON1_3: J3.13 ; port VD0
NetCON1_4: J3.27 ; port VD1
NetCON1_5: J3.14 ; port VD2
NetCON1_6: J3.43 ; port VD3
NetCON1_7: J3.11 ; port VD4
NetCON1_8: J2.64 ; port VD5
NetCON1_9: J2.65 ; port VD6
NetCON1_10: J3.12 ; port VD7
NetCON1_12: J3.31 ; port VD8
NetCON1_13: J2.66 ; port VD9
NetCON1_14: J2.62 ; port VD10
NetCON1_15: J2.68 ; port VD11
NetCON1_16: J3.24 ; port VD12
NetCON1_17: J3.9 ; port VD13
NetCON1_18: J2.55 ; port VD14
NetCON1_19: J3.7 ; port VD15
NetCON1_21: J2.70 ; port VD16
NetCON1_22: J3.10 ; port VD17
NetCON1_23: J2.56 ; port VD18
NetCON1_24: J3.8 ; port VD19
NetCON1_25: J3.6 ; port VD20
NetCON1_26: J3.5 ; port VD21
NetCON1_27: J2.51 ; port VD22
NetCON1_28: J2.60 ; port VD23
NetCON1_31: J8.17 R96.1 ; port I2CSDA0
NetCON1_32: J8.18 R67.2 ; port I2CSCL0
NetCON2_1: J1.29 ; port MMC0_DATA3
NetCON2_2: J1.28 ; port MMC0_CMD
NetCON2_7: J1.61 ; port MMC0_DATA0
NetCON2_8: J1.26 ; port MMC0_DATA1
NetCON2_9: J1.48 ; port MMC0_DATA2
NetCON2_10: J2.1 ; port MMC0_WPN
NetCON2_11: J1.59 ; port MMC0_CDN
NetDS1_2: J4.49 ; port GPE0
NetDZQ_2: J4.20 J12.19 ; port ADCIN0
NetH1_1: J1.21 ; port GPE1
NetJ1_3: J1.3 ; port ADDR6
NetJ1_4: J1.4 ; port ADDR8
NetJ1_5: J1.5 ; port ADDR5
NetJ1_6: J1.6 ; port ADDR10
NetJ1_7: J1.7 ; port ADDR1
NetJ1_8: J1.8 ; port ADDR11
NetJ1_9: J1.9 ; port ADDR2
NetJ1_10: J1.10 ; port ADDR13
NetJ1_11: J1.11 ; port ADDR3
NetJ1_12: J1.12 ; port WEN
NetJ1_13: J1.13 ; port ADDR0
NetJ1_14: J1.14 ; port ADDR16
NetJ1_15: J1.15 ; port AC97_RSTN
NetJ1_16: J1.16 ; port DATA15
NetJ1_17: J1.17 ; port AC97_SDI
NetJ1_18: J1.18 ; port DATA13
NetJ1_19: J1.19 ; port AC97_SDO
NetJ1_20: J1.20 ; port BEN0
NetJ1_22: J1.22 ; port DATA8
NetJ1_23: J1.23 ; port GPE3
NetJ1_25: J1.25 ; port GPE4
NetJ1_27: J1.27 J13.17 ; port RXD3
NetJ1_30: J1.30 J12.4 ; port SPICS0
NetJ1_31: J1.31 ; port RXD0
NetJ1_32: J1.32 J13.15 ; port RXD2
NetJ1_33: J1.33 J13.13 ; port RTSN1
NetJ1_34: J1.34 J4.30 ; port AC97_BITCLK
NetJ1_36: J1.36 ; port AC97_SYNC
NetJ1_37: J1.37 ; port CTSN0
NetJ1_38: J1.38 J12.9 ; port SPIMOSI1
NetJ1_39: J1.39 ; port CAMYDATA6
NetJ1_40: J1.40 ; port CLKOUT
NetJ1_41: J1.41 ; port CAMYDATA3
NetJ1_43: J1.43 ; port CAMYDATA4
NetJ1_44: J1.44 J13.14 ; port CTSN1
NetJ1_45: J1.45 ; port CAMRSTN
NetJ1_46: J1.46 ; port MMC1_DATA5
NetJ1_47: J1.47 ; port PWM_TOUT1
NetJ1_49: J1.49 ; port CAMPCLK
NetJ1_50: J1.50 ; port GPB4
NetJ1_51: J1.51 ; port CAMCLK
NetJ1_54: J1.54 J12.7 ; port SPICS1
NetJ1_55: J1.55 ; port CAMYDATA1
NetJ1_56: J1.56 ; port MMC1_DATA4
NetJ1_60: J1.60 ; port MMC0_CLK
NetJ1_62: J1.62 J12.3 ; port SPIMOSI0
NetJ1_63: J1.63 J12.6 ; port SPIMISO0
NetJ1_64: J1.64 J12.8 ; port SPIMISO1
NetJ1_65: J1.65 J13.16 ; port TXD2
NetJ1_66: J1.66 R67.1
NetJ1_67: J1.67 J13.18 ; port TXD3
NetJ1_68: J1.68 ; port RTSN0
NetJ1_69: J1.69 J13.11 ; port TXD1
NetJ1_70: J1.70 ; port TXD0
NetJ1_71: J1.71 ; port CAMYDATA7
NetJ1_72: J1.72 ; port CAMYDATA5
NetJ1_73: J1.73 ; port CAMYDATA2
NetJ1_74: J1.74 ; port CAMYDATA0
NetJ1_75: J1.75 ; port CAMVSYNC
NetJ1_76: J1.76 ; port CAMHREF
NetJ2_3: J2.3 ; port MMC1_DATA6
NetJ2_5: J2.5 R96.2
NetJ2_6: J2.6 J13.12 ; port RXD1
NetJ2_7: J2.7 J12.5 ; port SPICLK0
NetJ2_8: J2.8 J8.13 ; port KP_ROW6
NetJ2_9: J2.9 ; port EINT20
NetJ2_10: J2.10 J8.3 ; port KP_ROW1
NetJ2_11: J2.11 J13.6 ; port GPK5
NetJ2_12: J2.12 J8.7 ; port KP_ROW3
NetJ2_13: J2.13 ; port GPK4
NetJ2_14: J2.14 J8.15 ; port KP_ROW7
NetJ2_15: J2.15 ; port GPK1
NetJ2_16: J2.16 ; port USBDP
NetJ2_18: J2.18 ; port USBDN
NetJ2_19: J2.19 ; port GPK3
NetJ2_20: J2.20 J8.5 ; port KP_ROW2
NetJ2_21: J2.21 ; port EINT17
NetJ2_23: J2.23 J8.10 ; port KP_COL4
NetJ2_25: J2.25 ; port EINT19
NetJ2_26: J2.26 ; port XM1_CKE1
NetJ2_27: J2.27 ; port GPM4
NetJ2_28: J2.28 J8.9 ; port KP_ROW4
NetJ2_29: J2.29 ; port GPK0
NetJ2_30: J2.30 J8.11 ; port KP_ROW5
NetJ2_31: J2.31 ; port GPK2
NetJ2_32: J2.32 J8.1 ; port KP_ROW0
NetJ2_33: J2.33 J12.11 ; port EINT16
NetJ2_34: J2.34 ; port GPK7
NetJ2_36: J2.36 ; port GPK6
NetJ2_37: J2.37 ; port EINT18
NetJ2_38: J2.38 J8.12 ; port KP_COL5
NetJ2_39: J2.39 ; port NLED4
NetJ2_40: J2.40 ; port GPM5
NetJ2_41: J2.41 J8.2 ; port KP_COL0
NetJ2_44: J2.44 J8.4 ; port KP_COL1
NetJ2_45: J2.45 J8.6 ; port KP_COL2
NetJ2_46: J2.46 ; port NLED3
NetJ2_47: J2.47 ; port NLED1
NetJ2_48: J2.48 J8.16 ; port KP_COL7
NetJ2_49: J2.49 ; port NLED2
NetJ2_50: J2.50 J8.14 ; port KP_COL6
NetJ2_52: J2.52 ; port VSYNC
NetJ2_54: J2.54 J8.8 ; port KP_COL3
NetJ2_57: J2.57 ; port IRQ_LAN
NetJ2_59: J2.59 ; port EINT10
NetJ2_61: J2.61 ; port KEYINT6
NetJ2_63: J2.63 ; port KEYINT4
NetJ2_71: J2.71 ; port XNRSTOUT
NetJ3_3: J3.3 ; port VDEN
NetJ3_4: J3.4 ; port HSYNC
NetJ3_17: J3.17 ; port EINT9
NetJ3_18: J3.18 ; port EINT11
NetJ3_19: J3.19 ; port KEYINT3
NetJ3_20: J3.20 ; port KEYINT5
NetJ3_21: J3.21 ; port NBATF
NetJ3_22: J3.22 ; port KEYINT1
NetJ3_25: J3.25 ; port RTCK
NetJ3_28: J3.28 ; port PWRRGTON
NetJ3_30: J3.30 ; port OM0
NetJ3_34: J3.34 ; port DBGSEL
NetJ3_36: J3.36 ; port OTGID
NetJ3_38: J3.38 ; port OTGDP
NetJ3_40: J3.40 ; port OTGDM
NetJ3_44: J3.44 ; port EINT12
NetJ3_49: J3.49 ; port KEYINT2
NetJ3_52: J3.52 ; port DAC_OUT0
NetJ3_55: J3.55 ; port GPP14
NetJ3_57: J3.57 J13.5 ; port GPP13
NetJ3_59: J3.59 J13.3 ; port GPP9
NetJ3_61: J3.61 J13.2 ; port GPP8
NetJ3_62: J3.62 J13.4 ; port GPP12
NetJ3_63: J3.63 ; port GPQ5
NetJ3_64: J3.64 ; port GPQ4
NetJ3_66: J3.66 ; port ADDR17
NetJ3_67: J3.67 ; port KEY_RST
NetJ3_68: J3.68 ; port CSN4
NetJ3_69: J3.69 ; port CSN1
NetJ3_70: J3.70 ; port WAITN
NetJ3_71: J3.71 ; port ADDR19
NetJ3_72: J3.72 ; port GPO5
NetJ3_73: J3.73 ; port DATA12
NetJ3_74: J3.74 ; port CSN0
NetJ3_75: J3.75 J12.2 ; port DAC_OUT1
NetJ4_9: J4.9 ; port CSN2
NetJ4_10: J4.10 ; port FWEN
NetJ4_11: J4.11 ; port FREN
NetJ4_12: J4.12 ; port FALE
NetJ4_13: J4.13 ; port RNB
NetJ4_14: J4.14 ; port FCLE
NetJ4_15: J4.15 J12.18 ; port ADCIN3
NetJ4_18: J4.18 J12.17 ; port ADCIN2
NetJ4_19: J4.19 J12.20 ; port ADCIN1
NetJ4_22: J4.22 ; port GPQ6
NetJ4_23: J4.23 ; port GPP0
NetJ4_25: J4.25 ; port ADDR18
NetJ4_26: J4.26 ; port GPQ3
NetJ4_27: J4.27 ; port GPO4
NetJ4_28: J4.28 ; port CSN3
NetJ4_29: J4.29 ; port GPQ2
NetJ4_31: J4.31 ; port DATA9
NetJ4_32: J4.32 ; port DATA11
NetJ4_33: J4.33 ; port OEN
NetJ4_34: J4.34 J13.1 ; port GPP1
NetJ4_36: J4.36 ; port DATA14
NetJ4_37: J4.37 ; port ADDR12
NetJ4_38: J4.38 ; port ADDR14
NetJ4_39: J4.39 ; port BEN1
NetJ4_40: J4.40 ; port ADDR15
NetJ4_41: J4.41 ; port ADDR9
NetJ4_43: J4.43 ; port CSN5
NetJ4_44: J4.44 ; port ADDR7
NetJ4_45: J4.45 ; port ADDR4
NetJ4_47: J4.47 ; port MMC1_DATA7
NetJ4_48: J4.48 ; port GPE2
NetJ4_51: J4.51 J12.10 ; port SPICLK1
NetJ4_53: J4.53 ; port DATA2
NetJ4_54: J4.54 ; port DATA0
NetJ4_55: J4.55 ; port DATA3
NetJ4_56: J4.56 ; port DATA1
NetJ4_57: J4.57 ; port DATA6
NetJ4_59: J4.59 ; port DATA7
NetJ4_60: J4.60 ; port DATA5
NetJ4_62: J4.62 ; port DATA4

Not connected (* = marked no-connect by the designer): D1 3; R17 2

### Notes on the sheet
- RTC POWER
- (near J12) USER IO 1
- CONNECTORS
- (near J8) USER IO 2
- USER IO 3
- COMPANY:
- OK6410 Expansion Board
- TITLE:
- Forlinx Embedded
- HOME:
- www.forlinx.com

### Library data of the parts
BAT1 = BATTERY: PCB DECAL: BATTERY2
C34 = CAP1206: as C26 on sheet SD_SD_WIFI
J1-J4 = CONN40X2: PCB DECAL: CON80A_08_D
J8 J12 J13 = CON20: PCB DECAL: IDC20S
R17 R67 R96 = RESISTOR_2: PCB Footprint: C2012; PCB DECAL: 0603A
D1 = BAT54C: Value: BAT54C